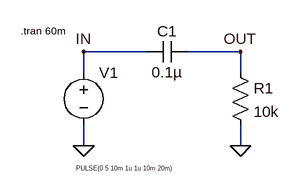
[diagram p0: schematic RC_High_Pass_Filter.asc]
RC_High_Pass_Filter.asc, the LTspice schematic file:
Version 4.1
SHEET 1 880 680
WIRE 144 80 48 80
WIRE 288 80 208 80
WIRE 48 112 48 80
WIRE 288 112 288 80
WIRE 48 224 48 192
WIRE 288 224 288 192
FLAG 48 224 0
FLAG 288 224 0
FLAG 48 80 IN
FLAG 288 80 OUT
SYMBOL voltage 48 96 R0
WINDOW 3 -11 162 Left 0
WINDOW 123 0 0 Left 0
WINDOW 39 0 0 Left 0
SYMATTR InstName V1
SYMATTR Value PULSE(0 5 10m 1u 1u 10m 20m)
SYMBOL cap 208 64 R90
WINDOW 0 0 32 VBottom 2
WINDOW 3 32 32 VTop 2
SYMATTR InstName C1
SYMATTR Value 0.1µ
SYMBOL res 272 96 R0
SYMATTR InstName R1
SYMATTR Value 10k
TEXT -48 48 Left 1 !.tran 60m

The netlist it stands for:
* RC_High_Pass_Filter.asc
V1 IN 0 PULSE(0 5 10m 1u 1u 10m 20m)
C1 OUT IN 0.1µ
R1 OUT 0 10k
.tran 60m
.backanno
.end

* Results of the author's LTspice run, read from the files saved beside the schematic
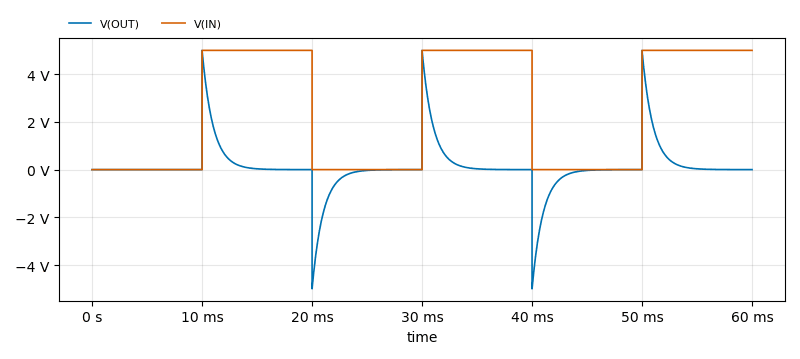
[diagram p1: Transient Analysis of RC_High_Pass_Filter.asc, plotted from the saved traces]
* Transient Analysis, 1 run:
*   V(OUT): min -4.997 V, max 4.998 V, average 83.33 mV, rms 1.021 V, last 226.5 µV
*   V(IN): min 0 V, max 5 V, average 2.5 V, rms 3.536 V, last 5 V